# EAGLE schematic Three GPS schematic (EAGLE 9.5.1)
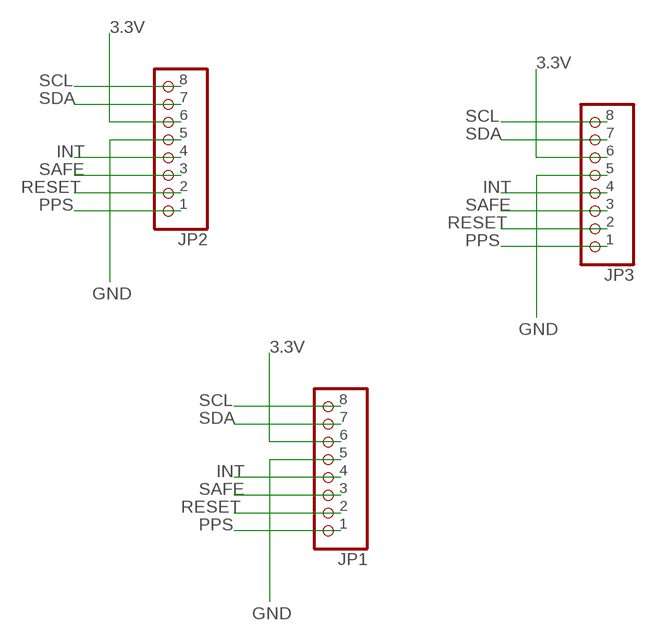
[diagram p0: schematic, sheet 1]

## Parts
JP1  PINHD-1X8  [1X08]
JP2  PINHD-1X8  [1X08]
JP3  PINHD-1X8  [1X08]

## Nets
3.3V: JP1.6 JP2.6 JP3.6
GND: JP1.5 JP2.5 JP3.5
INT: JP1.4 JP2.4 JP3.4
PPS: JP1.1 JP2.1 JP3.1
RESET: JP1.2 JP2.2 JP3.2
SAFE: JP1.3 JP2.3 JP3.3
SCL: JP1.8 JP2.8 JP3.8
SDA: JP1.7 JP2.7 JP3.7

## Library data of the parts
JP1-JP3 = pinhead:PINHD-1X8: PIN HEADER